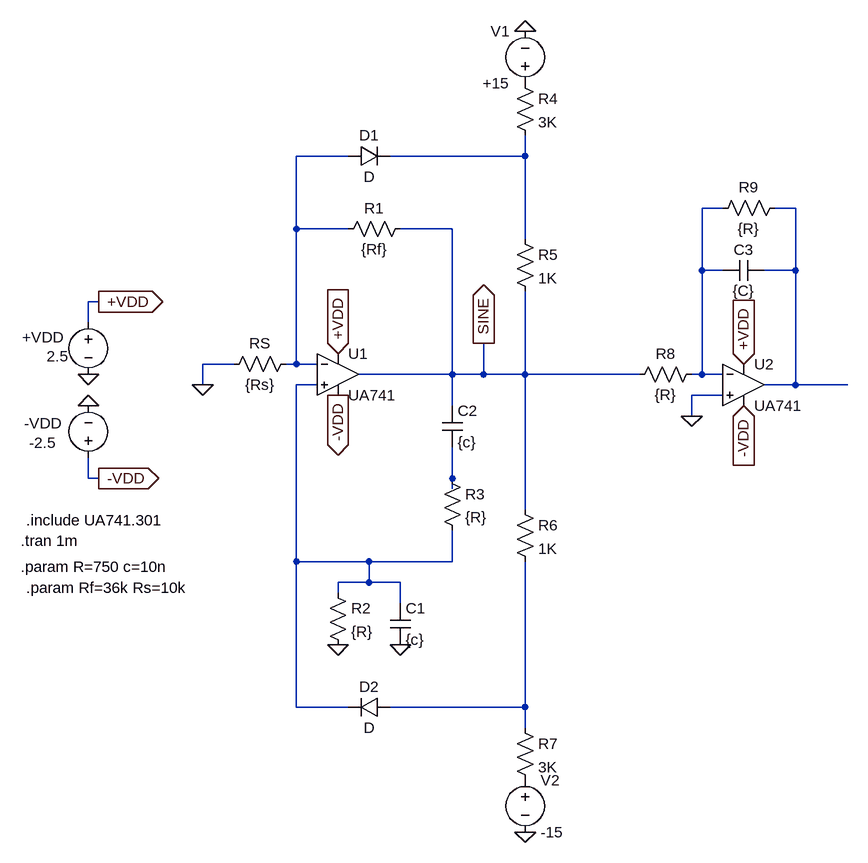
[diagram p0: schematic Oscillator.asc]
Oscillator.asc, the LTspice schematic file:
Version 4
SHEET 1 1112 900
WIRE 224 -160 144 -160
WIRE 496 -160 496 -192
WIRE 496 -160 288 -160
WIRE 800 -80 768 -80
WIRE 912 -80 880 -80
WIRE 144 -48 144 -160
WIRE 224 -48 144 -48
WIRE 384 -48 304 -48
WIRE 496 -32 496 -160
WIRE 768 16 768 -80
WIRE 800 16 768 16
WIRE 912 16 912 -80
WIRE 912 16 864 16
WIRE -160 64 -176 64
WIRE -176 96 -176 64
WIRE 48 160 0 160
WIRE 144 160 144 -48
WIRE 144 160 128 160
WIRE 176 160 144 160
WIRE 384 176 384 -48
WIRE 384 176 240 176
WIRE 432 176 432 128
WIRE 432 176 384 176
WIRE 496 176 496 48
WIRE 496 176 432 176
WIRE 672 176 496 176
WIRE 768 176 768 16
WIRE 768 176 752 176
WIRE 800 176 768 176
WIRE 0 192 0 160
WIRE 176 192 144 192
WIRE 912 192 912 16
WIRE 912 192 864 192
WIRE 992 192 912 192
WIRE 800 208 752 208
WIRE 384 224 384 176
WIRE 752 240 752 208
WIRE -176 336 -176 304
WIRE -160 336 -176 336
WIRE 384 336 384 288
WIRE 384 352 384 336
WIRE 496 384 496 176
WIRE 144 464 144 192
WIRE 256 464 144 464
WIRE 384 464 384 416
WIRE 384 464 256 464
WIRE 256 496 256 464
WIRE 256 496 208 496
WIRE 304 496 256 496
WIRE 208 512 208 496
WIRE 304 528 304 496
WIRE 144 688 144 464
WIRE 224 688 144 688
WIRE 496 688 496 464
WIRE 496 688 288 688
WIRE 496 720 496 688
FLAG -176 176 0
FLAG -176 224 0
FLAG -160 64 +VDD
IOPIN -160 64 Out
FLAG -160 336 -VDD
IOPIN -160 336 Out
FLAG 208 144 +VDD
IOPIN 208 144 In
FLAG 208 208 -VDD
IOPIN 208 208 Out
FLAG 0 192 0
FLAG 208 592 0
FLAG 304 592 0
FLAG 432 128 SINE
IOPIN 432 128 Out
FLAG 496 880 0
FLAG 496 -352 0
FLAG 752 240 0
FLAG 832 160 +VDD
IOPIN 832 160 In
FLAG 832 224 -VDD
IOPIN 832 224 In
SYMBOL voltage -176 80 R0
WINDOW 0 -102 39 Left 2
WINDOW 3 -64 68 Left 2
WINDOW 123 0 0 Left 0
WINDOW 39 0 0 Left 0
SYMATTR InstName +VDD
SYMATTR Value 2.5
SYMBOL voltage -176 320 R180
WINDOW 0 40 69 Left 2
WINDOW 3 49 39 Left 2
WINDOW 123 0 0 Left 0
WINDOW 39 0 0 Left 0
SYMATTR InstName -VDD
SYMATTR Value -2.5
SYMBOL OpAmps\\opamp2 208 112 R0
SYMATTR InstName U1
SYMATTR Value UA741
SYMBOL res 144 144 R90
WINDOW 0 0 56 VBottom 2
WINDOW 3 32 56 VTop 2
SYMATTR InstName RS
SYMATTR Value {Rs}
SYMBOL res 320 -64 R90
WINDOW 0 0 56 VBottom 2
WINDOW 3 32 56 VTop 2
SYMATTR InstName R1
SYMATTR Value {Rf}
SYMBOL res 192 496 R0
SYMATTR InstName R2
SYMATTR Value {R}
SYMBOL cap 288 528 R0
SYMATTR InstName C1
SYMATTR Value {c}
SYMBOL res 368 320 R0
SYMATTR InstName R3
SYMATTR Value {R}
SYMBOL cap 368 224 R0
SYMATTR InstName C2
SYMATTR Value {c}
SYMBOL diode 224 -144 R270
WINDOW 0 32 32 VTop 2
WINDOW 3 0 32 VBottom 2
SYMATTR InstName D1
SYMBOL diode 288 672 R90
WINDOW 0 0 32 VBottom 2
WINDOW 3 32 32 VTop 2
SYMATTR InstName D2
SYMBOL res 480 -288 R0
SYMATTR InstName R4
SYMATTR Value 3K
SYMBOL res 480 -48 R0
SYMATTR InstName R5
SYMATTR Value 1K
SYMBOL res 480 368 R0
SYMATTR InstName R6
SYMATTR Value 1K
SYMBOL res 480 704 R0
SYMATTR InstName R7
SYMATTR Value 3K
SYMBOL voltage 496 -256 R180
WINDOW 0 24 96 Left 2
WINDOW 3 24 16 Left 2
WINDOW 123 0 0 Left 0
WINDOW 39 0 0 Left 0
SYMATTR InstName V1
SYMATTR Value +15
SYMBOL voltage 496 784 R0
WINDOW 123 0 0 Left 0
WINDOW 39 0 0 Left 0
SYMATTR InstName V2
SYMATTR Value -15
SYMBOL OpAmps\\opamp2 832 128 R0
SYMATTR InstName U2
SYMATTR Value UA741
SYMBOL res 768 160 R90
WINDOW 0 0 56 VBottom 2
WINDOW 3 32 56 VTop 2
SYMATTR InstName R8
SYMATTR Value {R}
SYMBOL cap 864 0 R90
WINDOW 0 0 32 VBottom 2
WINDOW 3 32 32 VTop 2
SYMATTR InstName C3
SYMATTR Value {C}
SYMBOL res 896 -96 R90
WINDOW 0 0 56 VBottom 2
WINDOW 3 32 56 VTop 2
SYMATTR InstName R9
SYMATTR Value {R}
TEXT -280 432 Left 2 !.tran 1m
TEXT -280 472 Left 2 !.param R=750 c=10n
TEXT -272 504 Left 2 !.param Rf=36k Rs=10k
TEXT -272 400 Left 2 !.include UA741.301

The netlist it stands for:
* Oscillator.asc
V§+VDD +VDD 0 2.5
V§-VDD -VDD 0 -2.5
XU1 N005 N001 +VDD -VDD SINE UA741  ; pins In+ In- V+ V- OUT
RS N001 0 {Rs}
R1 SINE N001 {Rf}
R2 N005 0 {R}
C1 N005 0 {c}
R3 N006 N005 {R}
C2 SINE N006 {c}
D1 N001 N002 D
D2 N007 N005 D
R4 P001 N002 3K
R5 N002 SINE 1K
R6 SINE N007 1K
R7 N007 P002 3K
V1 P001 0 +15
V2 P002 0 -15
XU2 0 N003 +VDD -VDD N004 UA741  ; pins In+ In- V+ V- OUT
R8 N003 SINE {R}
C3 N004 N003 {C}
R9 N004 N003 {R}
.model D D
.lib standard.dio
.tran 1m
.param R=750 c=10n
.param Rf=36k Rs=10k
.include UA741.301
.backanno
.end